# Altium schematic sheet Current_Sense_2.SchDoc
size A3
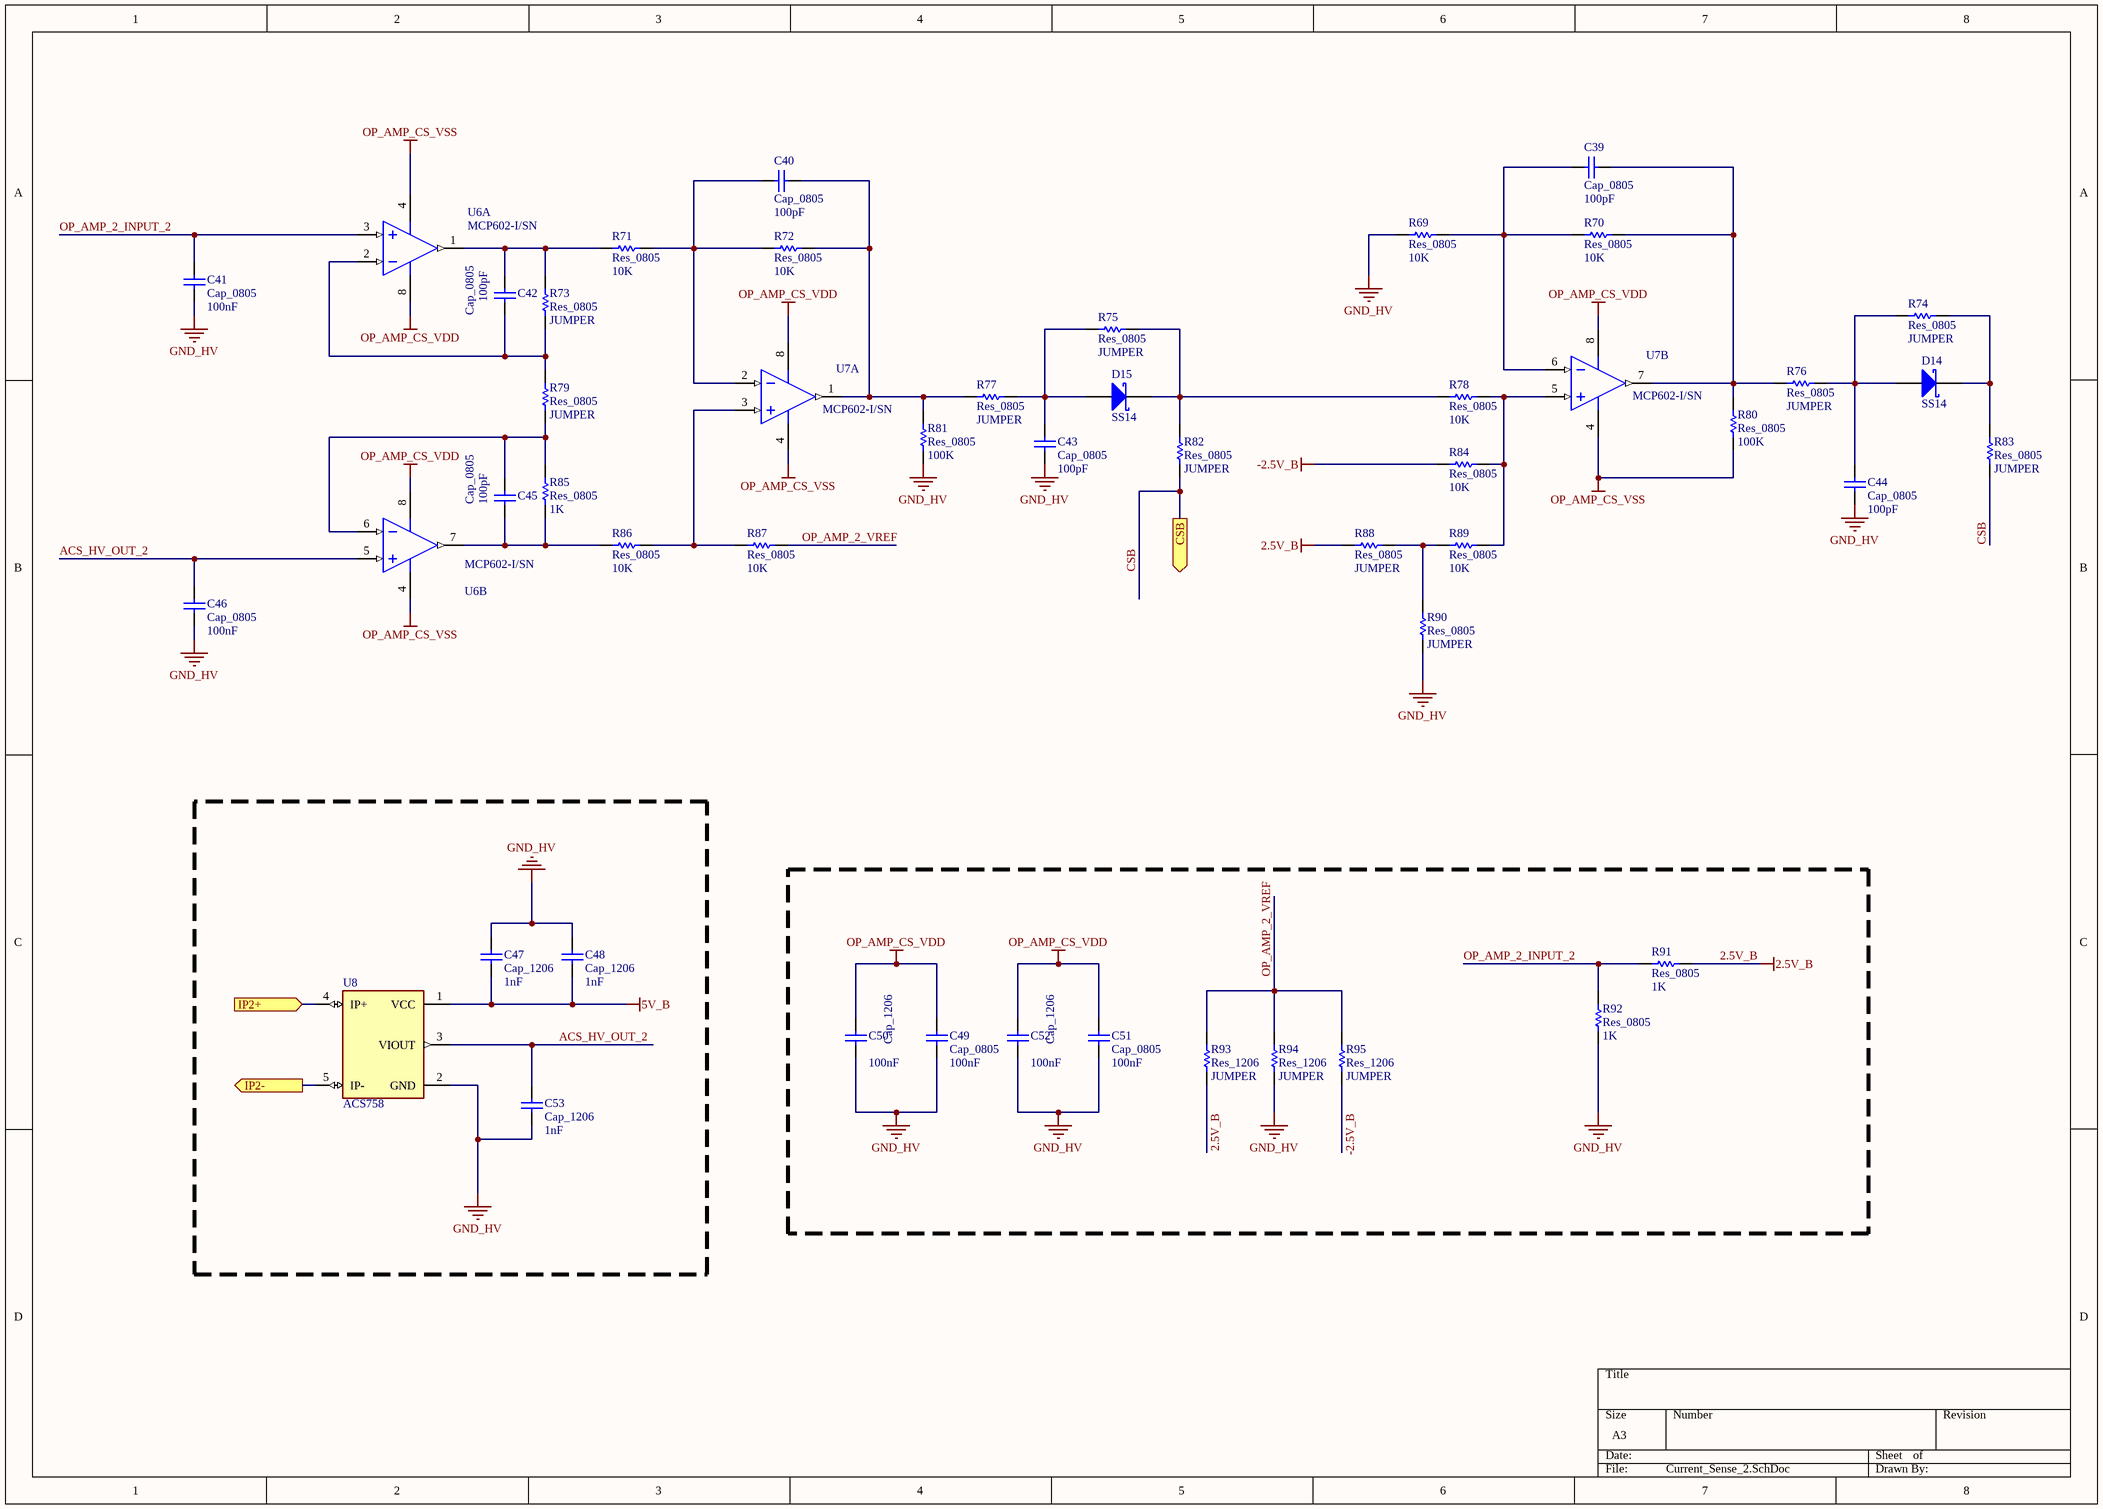
[diagram p0: Current_Sense_2.SchDoc]

## Parts
C39  Cap_0805  value 100pF  [SMD-0805C]
C40  Cap_0805  value 100pF  [SMD-0805C]
C41  Cap_0805  value 100nF  [SMD-0805C]
C42  Cap_0805  value 100pF  [SMD-0805C]
C43  Cap_0805  value 100pF  [SMD-0805C]
C44  Cap_0805  value 100pF  [SMD-0805C]
C45  Cap_0805  value 100pF  [SMD-0805C]
C46  Cap_0805  value 100nF  [SMD-0805C]
C47  Cap_1206  value 1nF  [SMD-1206C]
C48  Cap_1206  value 1nF  [SMD-1206C]
C49  Cap_0805  value 100nF  [SMD-0805C]
C50  Cap_1206  value 100nF  [SMD-1206C]
C51  Cap_0805  value 100nF  [SMD-0805C]
C52  Cap_1206  value 100nF  [SMD-1206C]
C53  Cap_1206  value 1nF  [SMD-1206C]
D14  SS14  [DIOM4226X22N]
D15  SS14  [DIOM4226X22N]
R69  Res_0805  value 10K  [WRIS-KSKE_0805_H=0.6mm]
R70  Res_0805  value 10K  [WRIS-KSKE_0805_H=0.6mm]
R71  Res_0805  value 10K  [WRIS-KSKE_0805_H=0.6mm]
R72  Res_0805  value 10K  [WRIS-KSKE_0805_H=0.6mm]
R73  Res_0805  value JUMPER  [WRIS-KSKE_0805_H=0.6mm]
R74  Res_0805  value JUMPER  [WRIS-KSKE_0805_H=0.6mm]
R75  Res_0805  value JUMPER  [WRIS-KSKE_0805_H=0.6mm]
R76  Res_0805  value JUMPER  [WRIS-KSKE_0805_H=0.6mm]
R77  Res_0805  value JUMPER  [WRIS-KSKE_0805_H=0.6mm]
R78  Res_0805  value 10K  [WRIS-KSKE_0805_H=0.6mm]
R79  Res_0805  value JUMPER  [WRIS-KSKE_0805_H=0.6mm]
R80  Res_0805  value 100K  [WRIS-KSKE_0805_H=0.6mm]
R81  Res_0805  value 100K  [WRIS-KSKE_0805_H=0.6mm]
R82  Res_0805  value JUMPER  [WRIS-KSKE_0805_H=0.6mm]
R83  Res_0805  value JUMPER  [WRIS-KSKE_0805_H=0.6mm]
R84  Res_0805  value 10K  [WRIS-KSKE_0805_H=0.6mm]
R85  Res_0805  value 1K  [WRIS-KSKE_0805_H=0.6mm]
R86  Res_0805  value 10K  [WRIS-KSKE_0805_H=0.6mm]
R87  Res_0805  value 10K  [WRIS-KSKE_0805_H=0.6mm]
R88  Res_0805  value JUMPER  [WRIS-KSKE_0805_H=0.6mm]
R89  Res_0805  value 10K  [WRIS-KSKE_0805_H=0.6mm]
R90  Res_0805  value JUMPER  [WRIS-KSKE_0805_H=0.6mm]
R91  Res_0805  value 1K  [WRIS-KSKE_0805_H=0.6mm]
R92  Res_0805  value 1K  [WRIS-KSKE_0805_H=0.6mm]
R93  Res_1206  value JUMPER  [WRIS-KSKE_1206_H=0.6mm]
R94  Res_1206  value JUMPER  [WRIS-KSKE_1206_H=0.6mm]
R95  Res_1206  value JUMPER  [WRIS-KSKE_1206_H=0.6mm]
U6  MCP602-I/SN  [SOIC127P570X175_HS-9N - No Thermal]  (parts A,B of 2)
U7  MCP602-I/SN  [SOIC127P570X175_HS-9N - No Thermal]  (parts A,B of 2)
U8  ACS758  [XDCR_ACS758]

## Ports
CSB (out), IP2+ (in), IP2- (out)

## Nets
2.5V_B: R88.1 R91.2 R93.1
5V_B: C47.2 C48.2 U8.1(VCC)
-2.5V_B: R84.2 R95.1
GND_HV: C41.1 C43.1 C44.1 C46.1 C47.1 C48.1 C49.1 C50.1 C51.1 C52.1 C53.1 R69.2 R81.2 R90.1 R92.1 R94.1 U8.2(GND)
OP_AMP_CS_VDD: C49.2 C50.2 C51.2 C52.2 U6.8(VDD) U7.8(VDD)
OP_AMP_CS_VSS: R80.2 U6.4(VSS) U7.4(VSS)
ACS_HV_OUT_2: C46.2 C53.2 U6.5(VINB+) U8.3(VIOUT)
CSB: R82.1 R83.1 ; port CSB
IP2+: U8.4(IP+) ; port IP2+
IP2-: U8.5(IP-) ; port IP2-
OP_AMP_2_INPUT_2: C41.2 R91.1 R92.2 U6.3(VINA+)
OP_AMP_2_VREF: R87.1 R93.2 R94.2 R95.2
NetC39_1: C39.1 R69.1 R70.2 U7.6(VINB-)
NetC39_2: C39.2 R70.1 R76.1 R80.1 U7.7(VOUTB)
NetC40_1: C40.1 R71.1 R72.2 U7.2(VINA-)
NetC40_2: C40.2 R72.1 R77.1 R81.1 U7.1(VOUTA)
NetC42_1: C42.1 R73.1 R79.2 U6.2(VINA-)
NetC42_2: C42.2 R71.2 R73.2 U6.1(VOUTA)
NetC43_2: C43.2 D15.2(A) R75.1 R77.2
NetC44_2: C44.2 D14.2(A) R74.1 R76.2
NetC45_1: C45.1 R85.1 R86.2 U6.7(VOUTB)
NetC45_2: C45.2 R79.1 R85.2 U6.6(VINB-)
NetD14_1: D14.1(K) R74.2 R83.2
NetD15_1: D15.1(K) R75.2 R78.2 R82.2
NetR78_1: R78.1 R84.1 R89.1 U7.5(VINB+)
NetR86_1: R86.1 R87.2 U7.3(VINA+)
NetR88_2: R88.2 R89.2 R90.2

## Library data of the parts
C39-C53 = Cap: Capacitor; Published: 8-Jun-2000; LatestRevisionDate: 17-Jul-2002; LatestRevisionNote: Re-released for DXP Platform.; PackageReference: RAD-0.3; Publisher: Altium Limited; PackageDescription: Radial Cap, Thru-Hole; 2 Leads; 0.3 in Pin Spacing
D14 D15 = SS14: Schottky Rectifier, 1.1 W, -65 to 125 degC, 2-Pin SMD, RoHS, Tape and Reel; Manufacturer: Fairchild; Configuration: SINGLE; Diode Element Material: SILICON; Power Dissipation Limit-Max (W): 1.1; Additional Feature: FREEWHEELINGDIODE; Signal Diode Type: SIGNALDIODE; Number of Elements: 1; JEDEC-95 Code: DO-214AC; Rep Pk Reverse Voltage-Max (V): 40; Package Body Material: PLASTIC/EPOXY; CAGE Code: 1HBD3,07933,59621,7D893; Peak Reflow Temperature (Cel): 260; Package Shape: RECTANGULAR; Manufacturer URL: https://www.fairchildsemi.com/; JESD-97 Code: e3; Package Reference: DO-214AC-2; RoHS Compliant: YES; Package Description: 2-Pin Surface Mount Device, Body 4.375 x 2.725 mm; Technology: SCHOTTKY; Surface Mount: YES; Datasheet URL: http://www.onlinecomponents.com/datasheet/ss14.aspx?p=11369800; Terminal Form: CBEND; Package Style: SMALLOUTLINE; Number of Terminals: 2; JESD-30 Code: R-PDSO-C2; Average Forward Current-Max (A): 1; Terminal Finish: MATTETIN; Datasheet Version: Oct-13; Terminal Position: DUAL; Package URL: https://www.fairchildsemi.com/package-drawings/DO/DO214AC.pdf; Moisture Sensitivity Level: 1; Lead Free: YES
R69-R95 = Res1: Resistor; Published: 8-Jun-2000; LatestRevisionDate: 17-Jul-2002; LatestRevisionNote: Re-released for DXP Platform.; PackageReference: AXIAL-0.3; Publisher: Altium Limited; PackageDescription: Axial Device, Thru-Hole; 2 Leads; 0.3 in Pin Spacing
U6 U7 = MCP602_2: 2.7V to 6.0V Single Supply CMOS Operational Amplifier, 8-Pin SOIC, Industrial Temperature; ComponentLink1URL: http://www.microchip.com/; ComponentLink1Description: Manufacturer URL; RevisionNote: URLs added.; PackageReference: SOIC-SN8; ComponentLink2URL: http://ww1.microchip.com/downloads/en/DeviceDoc/21314g.pdf; ComponentLink3URL: http://www.microchip.com/stellent/groups/techpub_sg/documents/packagingspec/en012702.pdf; PackageDescription: 8-Lead Plastic Small Outline (SN) - Narrow, 3.90mm Body [SOIC]; DatasheetVersion: revG, Dec-2007; ComponentLink2Description: Datasheet; ComponentLink3Description: Package Specification; Code_IPC: SOIC127P600-8; Code_JEDEC: MS-012; PackageVersion: revBB, Aug-2009
U8 = ACS758: Current Sensor 50A 1 Channel Hall Effect, Open Loop Unidirectional 5-CB Formed Leads, PFF; MF: Allegro MicroSystems LLC; Package: 5-CB-5 Allegro MicroSystems LLC; MP: ACS758; Availability: Unavailable; Price: None; Value: *; SnapEDA_Link: https://www.snapeda.com/parts/ACS758/Allegro%20MicroSystems%20LLC/view-part/226237/?ref=snap